# Altium schematic sheet MISC.schdoc
size Tabloid
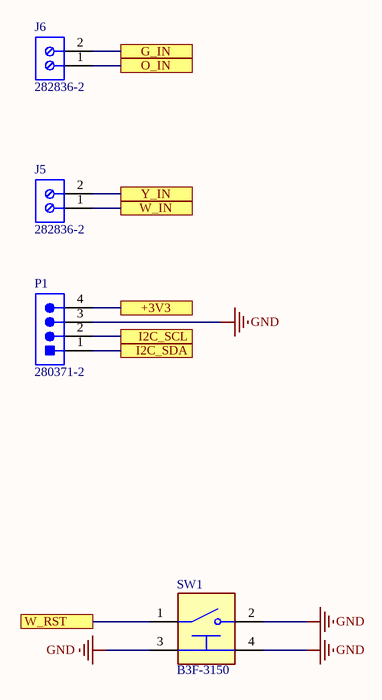
[diagram p0: MISC.schdoc]

## Parts
J5  282836-2  [TECO-282836-2_V]
J6  282836-2  [TECO-282836-2_V]
P1  280371-2  [TECO-280371-2_V]
SW1  B3F-3150  [FP-B3F-3150-MFG]

## Ports
+3V3, G_IN, I2C_SCL, I2C_SDA, O_IN, W_IN, W_RST, Y_IN

## Nets
GND: P1.3 SW1.2 SW1.3(MNT_1) SW1.4(MNT_2)
+3V3: P1.4 ; port +3V3
G_IN: J6.2 ; port G_IN
I2C_SCL: P1.2 ; port I2C_SCL
I2C_SDA: P1.1 ; port I2C_SDA
O_IN: J6.1 ; port O_IN
W_IN: J5.1 ; port W_IN
W_RST: SW1.1 ; port W_RST
Y_IN: J5.2 ; port Y_IN

## Notes on the sheet
- Title
- Size:
- Date:
- Tabloid
- Number:
- Time:
- Revision:
- Sheet
- of
- File:

## Library data of the parts
J5 J6 = CMP-1684-00017-1: Female Header, Pitch 5 mm, 1 x 2 Position, Height 10 mm, Tail Length 3.5 mm, Rohs, Bulk; Manufacturer: TE Connectivity; Wire Gauge: 16-30AWG; Product Training Modules: Wire-to-BoardEurostyleTerminalBlocks; Clamp Material - Plating: Brass-NickelPlated; Voltage: 300V; Mating Orientation: HorizontalwithBoard; Current: 13.5A; Pitch: 0.197"(5.00mm); Screw Thread: M3; 3D Model: 282836-2.pdf; Other Names: 5ULV-02B / A98076; Dynamic Catalog: BuchananSeries; Number of Levels: 1; Torque - Screw: 0.68Nm(6Lb-In); Featured Product: EurostyleTerminalBlockConnectors; Positions Per Level: 2; Wire Termination: Screw-RisingCageClamp; Datasheet URL: http://www.te.com.cn/commerce/DocumentDelivery/DDEController?Action=showdoc&DocId=Catalog+Section%7F1308389_EUROSTYLE_TERMINAL_BLOCKS%7F0607%7Fpdf%7FEnglish%7FENG_CS_1308389_EUROSTYLE_TERMINAL_BLOCKS_0607.pdf%7F282836-2; Color: Green; Family: TerminalBlocks-WiretoBoard; RoHS Information: 282836-2StatementofCompliance; Standard Package: 300; Contact Material - Plating: Brass-TinPlated; Manufacturer URL: http://www.te.com; Housing Material: Polyamide(PA66),Nylon6/6; Features: Interlocking(Side); Package Description: Female Header, Pitch 5 mm, 1 x 2 Position, Height 10 mm, Tail Length 3.5 mm; Mounting Type: ThroughHole; Package Reference: THD; Packaging: Bulk; Series: Buchanan; Category: Connectors,Interconnects; Screw Material - Plating: Brass-NickelPlated
P1 = CMP-2000-05548-1: Male Header, Pitch 2.54 mm, 1 x 4 Position, Height 12.8 mm, Tail Length 3.5 mm, -55 to 105 degC, RoHS, Bulk; Manufacturer: TE Connectivity; Pitch: 0.100"(2.54mm); Connector Type: Header,Shrouded; Other Names: 280371-2-ND / A106401; Number of Positions Loaded: All; Dynamic Catalog: AMPMODUModIISeries; Number of Positions: 4; 3D Model: 280371-2.pdf; Termination: Solder; Package Description: Male Header, Pitch 2.54 mm, 1 x 4 Position, Height 12.8 mm, Tail Length 3.5 mm; Datasheet Version: Rev. M1, 08/2016; Contact Mating Length: 0.260"(6.60mm); Datasheet URL: http://www.te.com/commerce/DocumentDelivery/DDEController?Action=showdoc&DocId=Customer+Drawing%7F280370%7FM1%7Fpdf%7FEnglish%7FENG_CD_280370_M1.pdf%7F280371-2; Mounting Technology: ThroughHole; Standard Package: 1,000; Contact Finish Thickness: 15µin(0.38µm); Contact Finish: Gold; Contact Type: MalePin; Packaging: Bulk; Mounting Type: ThroughHole; Number of Rows: 1; Family: RectangularConnectors-Headers,MalePins; Manufacturer URL: http://www.te.com/; Color: Black; RoHS Information: 280371-2StatementofCompliance; Package Reference: 280371-2; Category: Connectors,Interconnects; Series: AMPMODUModII
SW1 = CMP-08834-000006-1: SWITCH TACTILE SPST-NO 0.05A 24V; Manufacturer: Omron; Contact Current Rating: 50mA; Electromechanical Life: 1000000Cycles; Description: Tactile Switch SPST-NO Side Actuated Through Hole, Right Angle; Contact Resistance: 100mΩ; Operating Force: 0.98N; Octopart: https://octopart.com/b3f-3150-omron-49234; Device Class L1: Electromechanical; Device Class L2: Switches; Temperature Range Low: -25°C; Temperature Range High: +70°C; Mouser Description: Tactile Switches R/A 6X6 6.15mm BTN; Temperature: -25°C to +70°C; Voltage Rating Dc: 24V; Automotive: No; Ambient Temperature Range Low: -25°C; Ambient Temperature Range High: +70°C; Mount: Through Hole; ComponentLink2URL: https://omronfs.omron.com/en_US/ecb/products/pdf/en-b3f.pdf; RoHS: TRUE; ComponentLink2Description: Datasheet; Digikey Description: SWITCH TACTILE SPST-NO 0.05A 24V; Package: 0; Height: 7.8mm; Throw Configuration: SPST-NO; Lead Free: Yes; Device Class L3: Tactile Switches; Category: Switch; Manufacturer Part Number: B3F-3150